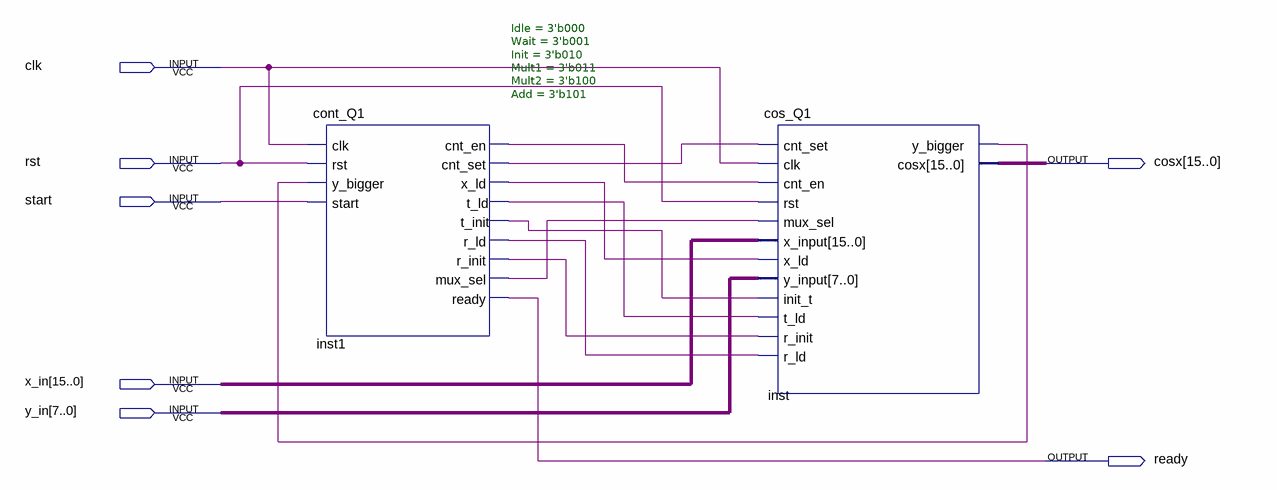
[diagram p0: schematic sheet]
// Quartus schematic final_cosx_Q1.bdf as structural Verilog: 2 symbols, 7 pins
module final_cosx_Q1 (
  input  clk,
  input  rst,
  input  start,
  input  [15:0] x_in,
  input  [7:0] y_in,
  output [15:0] cosx,
  output ready
);

  wire inst1_cnt_en, inst1_cnt_set, inst1_mux_sel, inst1_r_init, inst1_r_ld, inst1_t_init, inst1_t_ld,
       inst1_x_ld, inst_y_bigger;

  cont_Q1 #(.Idle(3'b000), .Wait(3'b001), .Init(3'b010), .Mult1(3'b011), .Mult2(3'b100), .Add(3'b101)) inst1 (
    .clk(clk), .rst(rst), .y_bigger(inst_y_bigger), .start(start), .cnt_en(inst1_cnt_en),
    .cnt_set(inst1_cnt_set), .x_ld(inst1_x_ld), .t_ld(inst1_t_ld), .t_init(inst1_t_init), .r_ld(inst1_r_ld),
    .r_init(inst1_r_init), .mux_sel(inst1_mux_sel), .ready(ready));
  cos_Q1 inst (
    .cnt_set(inst1_cnt_set), .clk(clk), .cnt_en(inst1_cnt_en), .rst(rst), .mux_sel(inst1_mux_sel),
    .x_input(x_in), .x_ld(inst1_x_ld), .y_input(y_in), .init_t(inst1_t_init), .t_ld(inst1_t_ld),
    .r_init(inst1_r_init), .r_ld(inst1_r_ld), .y_bigger(inst_y_bigger), .cosx(cosx));
endmodule
